# Altium schematic sheet TDesktop.SchDoc: LiveDesign Evaluation - Stop Watch
size A4; Organization: Altium Limited; Address1: L3, 12a Rodborough Rd; Address2: Frenchs Forest; Address3: NSW; Address4: Australia 2086; DocumentNumber: 5; SheetNumber: 5; SheetTotal: 7
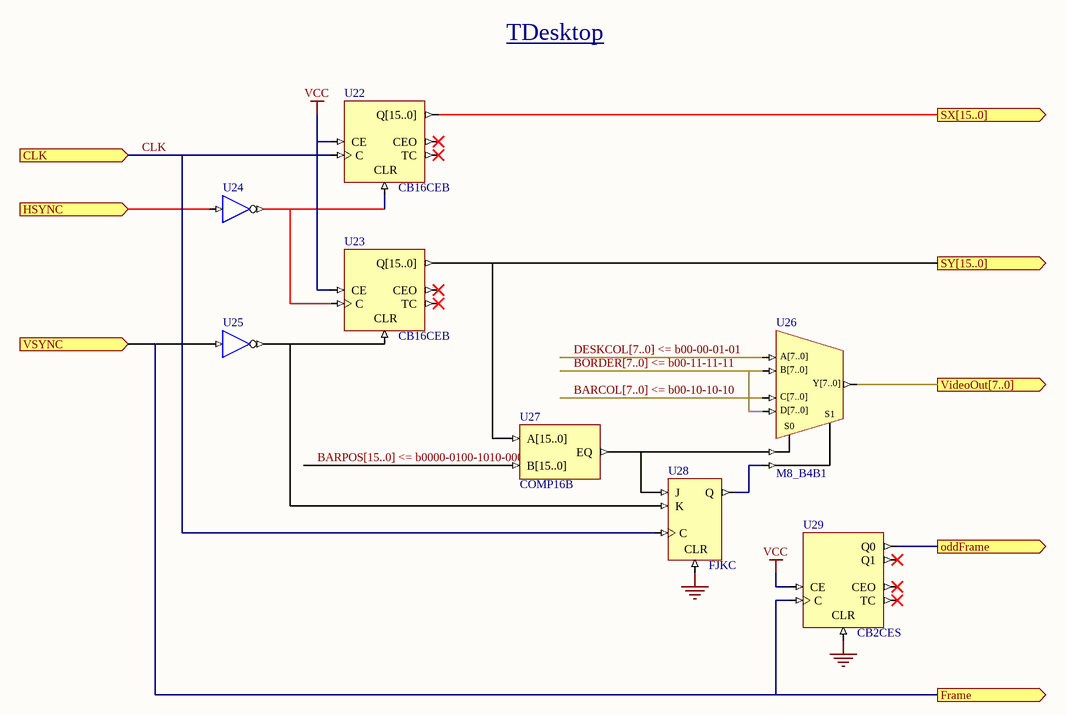
[diagram p0: TDesktop.SchDoc]

## Parts
U22  CB16CEB
U23  CB16CEB
U24  INV  (value not drawn)
U25  BUF  (value not drawn)
U26  M8_B4B1
U27  COMP16B
U28  FJKC
U29  CB2CES

## Ports
CLK (in), Frame (out), HSYNC (in), oddFrame (out), SX[15..0] (out), SY[15..0] (out), VideoOut[7..0] (out), VSYNC (in)

## Nets
GND: U28.CLR U29.CLR
VCC: U22.CE U23.CE U29.CE
BARCOL[7..0] <= b00-10-10-10: U26.C[7..0]
BARPOS[15..0] <= b0000-0100-1010-000: U27.B[15..0]
BORDER[7..0] <= b00-11-11-11: U26.B[7..0] U26.D[7..0]
CLK: U22.C U28.C ; port CLK
DESKCOL[7..0] <= b00-00-01-01: U26.A[7..0]
Frame: U25.I U29.C ; port VSYNC, port Frame
HSYNC: U24.I ; port HSYNC
oddFrame: U29.Q0 ; port oddFrame
SX[15..0]: U22.Q[15..0] ; port SX[15..0]
SY[15..0]: U23.Q[15..0] U27.A[15..0] ; port SY[15..0]
VideoOut[7..0]: U26.Y[7..0] ; port VideoOut[7..0]
NetU22_CLR: U22.CLR U23.C U24.O
NetU23_CLR: U23.CLR U25.O U28.K
NetU26_S0: U26.S0 U27.EQ U28.J
NetU26_S1: U26.S1 U28.Q

Not connected (* = marked no-connect by the designer): U22 CEO* TC*; U23 CEO* TC*; U29 CEO* Q1* TC*

## Buses and harness runs
bus BARCOL[7..0] <= b00-10-10-10
bus BARPOS[15..0] <= b0000-0100-1010-000
bus BORDER[7..0] <= b00-11-11-11
bus DESKCOL[7..0] <= b00-00-01-01

## Notes on the sheet
- TDesktop
- Title
- Size:
- Date:
- A4
- Number:
- Time:
- Revision:
- Sheet
- of
- File:

## Library data of the parts
U22 U23 = CB16CEB: 16-Bit Cascadable Binary Counters with Clock Enable and Asynchronous Clear, Bus Version; Xilinx Equivalent: CB16CE; ArchiveName: GENERIC; VHDLIB_SIM: GENERIC_LIB; Published: 29-Jan-2004; Publisher: Altium Limited; Core Revision: 1.00.00
U24 U25 = INV: Inverter; ArchiveName: GENERIC; VHDLIB_SIM: GENERIC_LIB; Published: 29-Jan-2004; Publisher: Altium Limited; Xilinx Equivalent: INV; Core Revision: 1.00.00
U26 = M8_B4B1: 4x8-Bit Bus to 1x8-Bit Bus Multiplexer; ArchiveName: GENERIC; VHDLIB_SIM: GENERIC_LIB; Published: 29-Jan-2004; Publisher: Altium Limited; Core Revision: 1.00.00
U27 = COMP16B: 16-Bit Identity Comparator, Bus Version; Xilinx Equivalent: COMP16; ArchiveName: GENERIC; VHDLIB_SIM: GENERIC_LIB; Published: 29-Jan-2004; Publisher: Altium Limited; Core Revision: 1.00.00
U28 = FJKC: J-K Flip-Flop with Asynchronous Clear; ArchiveName: GENERIC; VHDLIB_SIM: GENERIC_LIB; Published: 29-Jan-2004; Publisher: Altium Limited; Xilinx Equivalent: FJKC; Core Revision: 1.00.00
U29 = CB2CES: 2-Bit Cascadable Binary Counters with Clock Enable and Asynchronous Clear, Single Pin Version; Xilinx Equivalent: CB2CE; ArchiveName: GENERIC; VHDLIB_SIM: GENERIC_LIB; Published: 29-Jan-2004; Publisher: Altium Limited; Core Revision: 1.00.00